# Altium schematic sheet ManInTheMiddleCable.SchDoc: Man In the Middle Cable
size Letter; Author: Dr. Jeremy Daily; CompanyName: The University of Tulsa; Organization: Mechanical Engineering; Address1: 800 S. Tucker Dr.; Address2: Tulsa, OK 74104; DocumentNumber: Breakout for Heavy Vehicles; Revision: 1; SheetNumber: 1; SheetTotal: 6
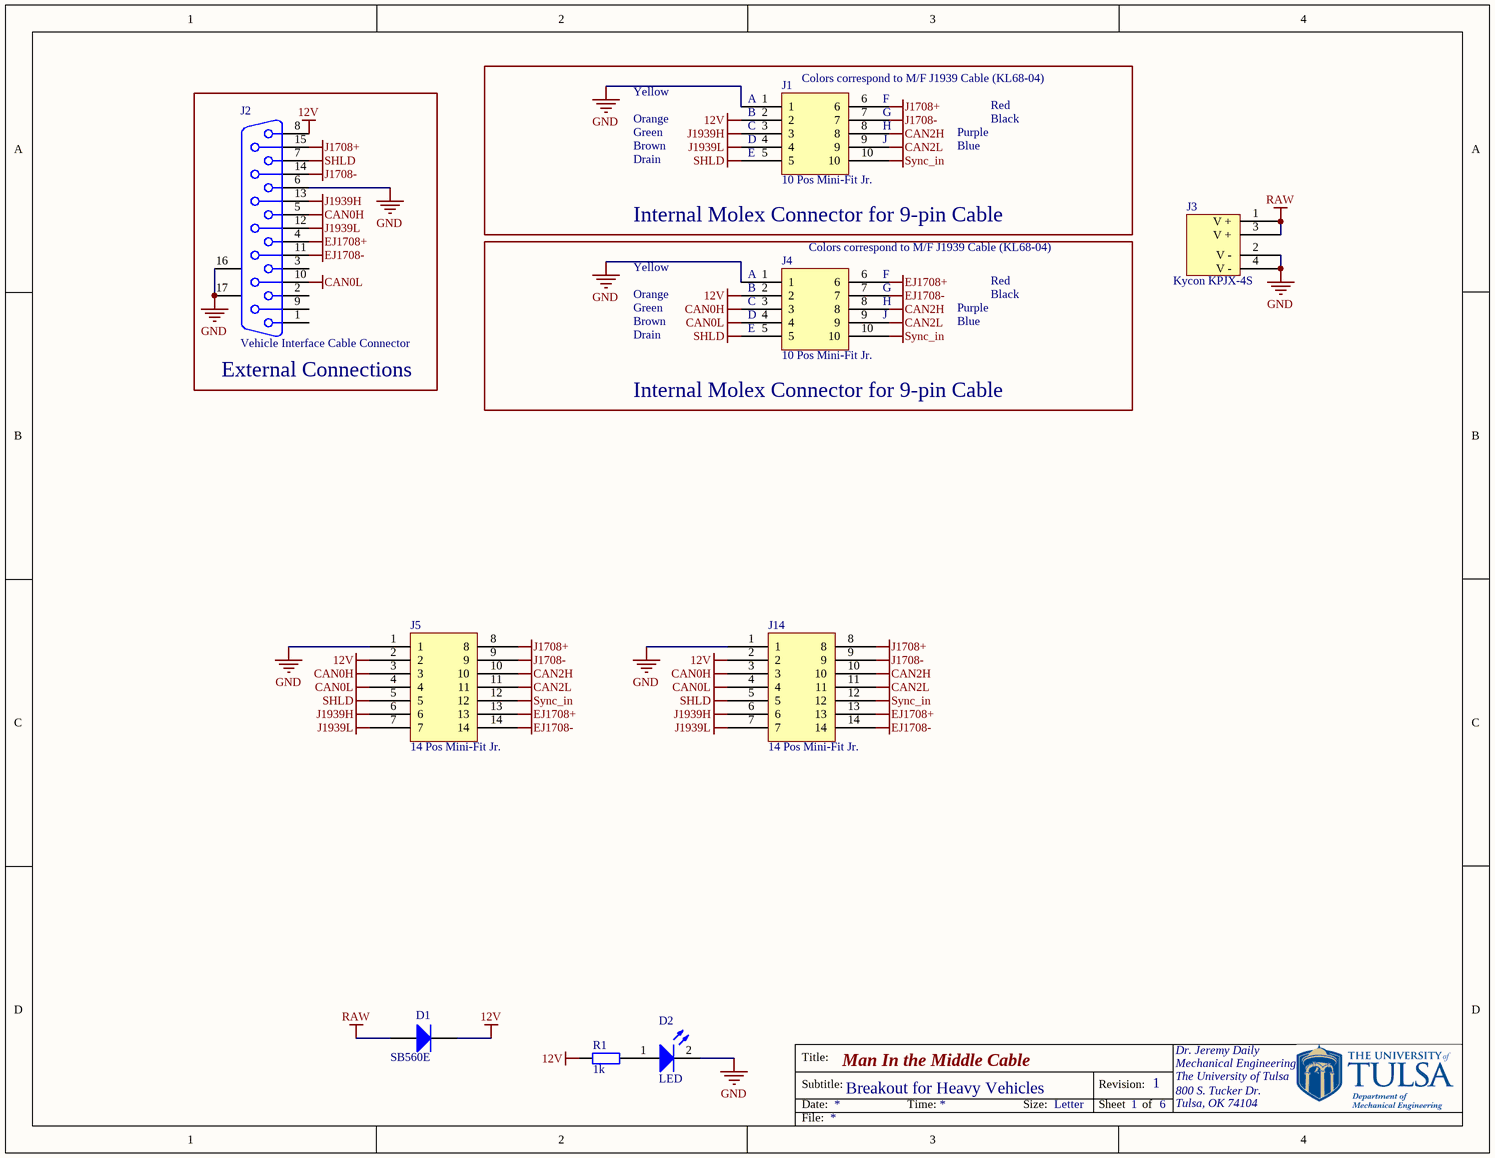
[diagram p0: ManInTheMiddleCable.SchDoc]

## Parts
D1  SB560E  [DO-201AD]
D2  LED  [LED - 5mm Through Hole]
J1  10 Pos Mini-Fit Jr.  [10 pos Mini-Fit Jr. R/A Header]
J2  Vehicle Interface Cable Connector  [DSUB1.385-2H15]
J3  Kycon KPJX-4S  [KPJX-4S-S]
J4  10 Pos Mini-Fit Jr.  [10 pos Mini-Fit Jr. R/A Header]
J5  14 Pos Mini-Fit Jr.  [14 pos Mini-Fit Jr. R/A Header]
J14  14 Pos Mini-Fit Jr.  [14 pos Mini-Fit Jr. R/A Header]
R1  1k  [AXIAL-0.4]

## Blocks framed on the sheet
External Connections: J2
Internal Molex Connector for 9-pin Cable: J1

## Nets
12V: D1.2(K) J1.2 J2.8 J4.2 J5.2 J14.2 R1.1
CAN0H: J2.5 J4.3 J5.3 J14.3
CAN0L: J2.10 J4.4 J5.4 J14.4
CAN2H: J1.8 J4.8 J5.10 J14.10
CAN2L: J1.9 J4.9 J5.11 J14.11
EJ1708+: J2.4 J4.6 J5.13 J14.13
EJ1708-: J2.11 J4.7 J5.14 J14.14
GND: D2.2(K) J1.1 J2.6 J2.16(MH1) J2.17(MH2) J3.2(V_-) J3.4(V_-) J4.1 J5.1 J14.1
J1708+: J1.6 J2.15 J5.8 J14.8
J1708-: J1.7 J2.14 J5.9 J14.9
J1939H: J1.3 J2.13 J5.6 J14.6
J1939L: J1.4 J2.12 J5.7 J14.7
RAW: D1.1(A) J3.1(V_+) J3.3(V_+)
SHLD: J1.5 J2.7 J4.5 J5.5 J14.5
Sync_in: J1.10 J4.10 J5.12 J14.12
NetD2_1: D2.1(A) R1.2

Not connected (* = marked no-connect by the designer): J2 1 2 3 9

## Notes on the sheet
- Yellow
- (near J1) A
- (near J1) Colors correspond to M/F J1939 Cable (KL68-04)
- (near J1) F
- Drain
- Brown
- Green
- Orange
- (near J1) B
- (near J1) C
- (near J1) D
- (near J1) E
- (near J1) G
- (near J1) H
- (near J1) J
- Blue
- Purple
- Black
- Red
- (near J4) A
- (near J4) B
- (near J4) Colors correspond to M/F J1939 Cable (KL68-04)
- (near J4) F
- (near J4) G
- (near J4) C
- (near J4) D
- (near J4) E
- (near J4) H
- (near J4) J
- (near J4) Internal Molex Connector for 9-pin Cable
- Title:
- Subtitle:
- Date:
- Time:
- Size:
- Letter
- Revision:
- Sheet
- of
- File:

## Library data of the parts
D1 = Diode 1N4003: Schottky Diodes & Rectifiers 2.0 Amp 150 Volt; Manufacturer: STMicroelectronics; PartNumber: STPS2150; Supplier 1: Mouser; Supplier Part Number 1: 511-STPS2150
D2 = SMT LED: LED COOL WHITE CLR 4.8MM RND T/H; Manufacturer: Cree Inc.; PartNumber: C535A-WJN-CT0W0231; Supplier 1: Digi-Key; Supplier Part Number 1: C535A-WJN-CT0W0231-ND; Value: White
J1 J4 = 10 Pos Header: 10 Positions Header - Shrouded Connector 0.165in (4.20mm) Through Hole - Right Angle Gold; Manufacturer: Molex; Supplier 1: Digi-Key; PartNumber: 39-30-1102; Supplier Part Number 1: WM21367-ND
J2 = D Connector 15: Receptacle Assembly, 15 Position, Right Angle; Manufacturer: Amphenol FCI; PartNumber: D15S33E4GV00LF; Supplier 1: Digi-Key; Supplier Part Number 1: 609-1498-ND
J3 = Power Entry Jack - 4 Pin: DC Power Connectors 4P JACK SKT SHIELDED SNAP AND LOCK; Manufacturer: Kycon; PartNumber: KPJX-4S-S; Supplier 1: Mouser; Supplier Part Number 1: 806-KPJX-4S-S
J5 J14 = 14 Pos Header: Manufacturer: Molex; Supplier 1: Digi-Key; Supplier 2: Mouser; PartNumber: 39-30-1140; Supplier Part Number 2: 538-39-30-1140
R1 = Res2: RES 330 OHM 1/4W 1% AXIAL; Manufacturer: Stackpole Electronics Inc.; PartNumber: RNMF14FTC330R; Value: 330; Supplier 1: Digi-Key; Supplier Part Number 1: S330CACT-ND